# Altium schematic sheet Sheet1.SchDoc
size A3
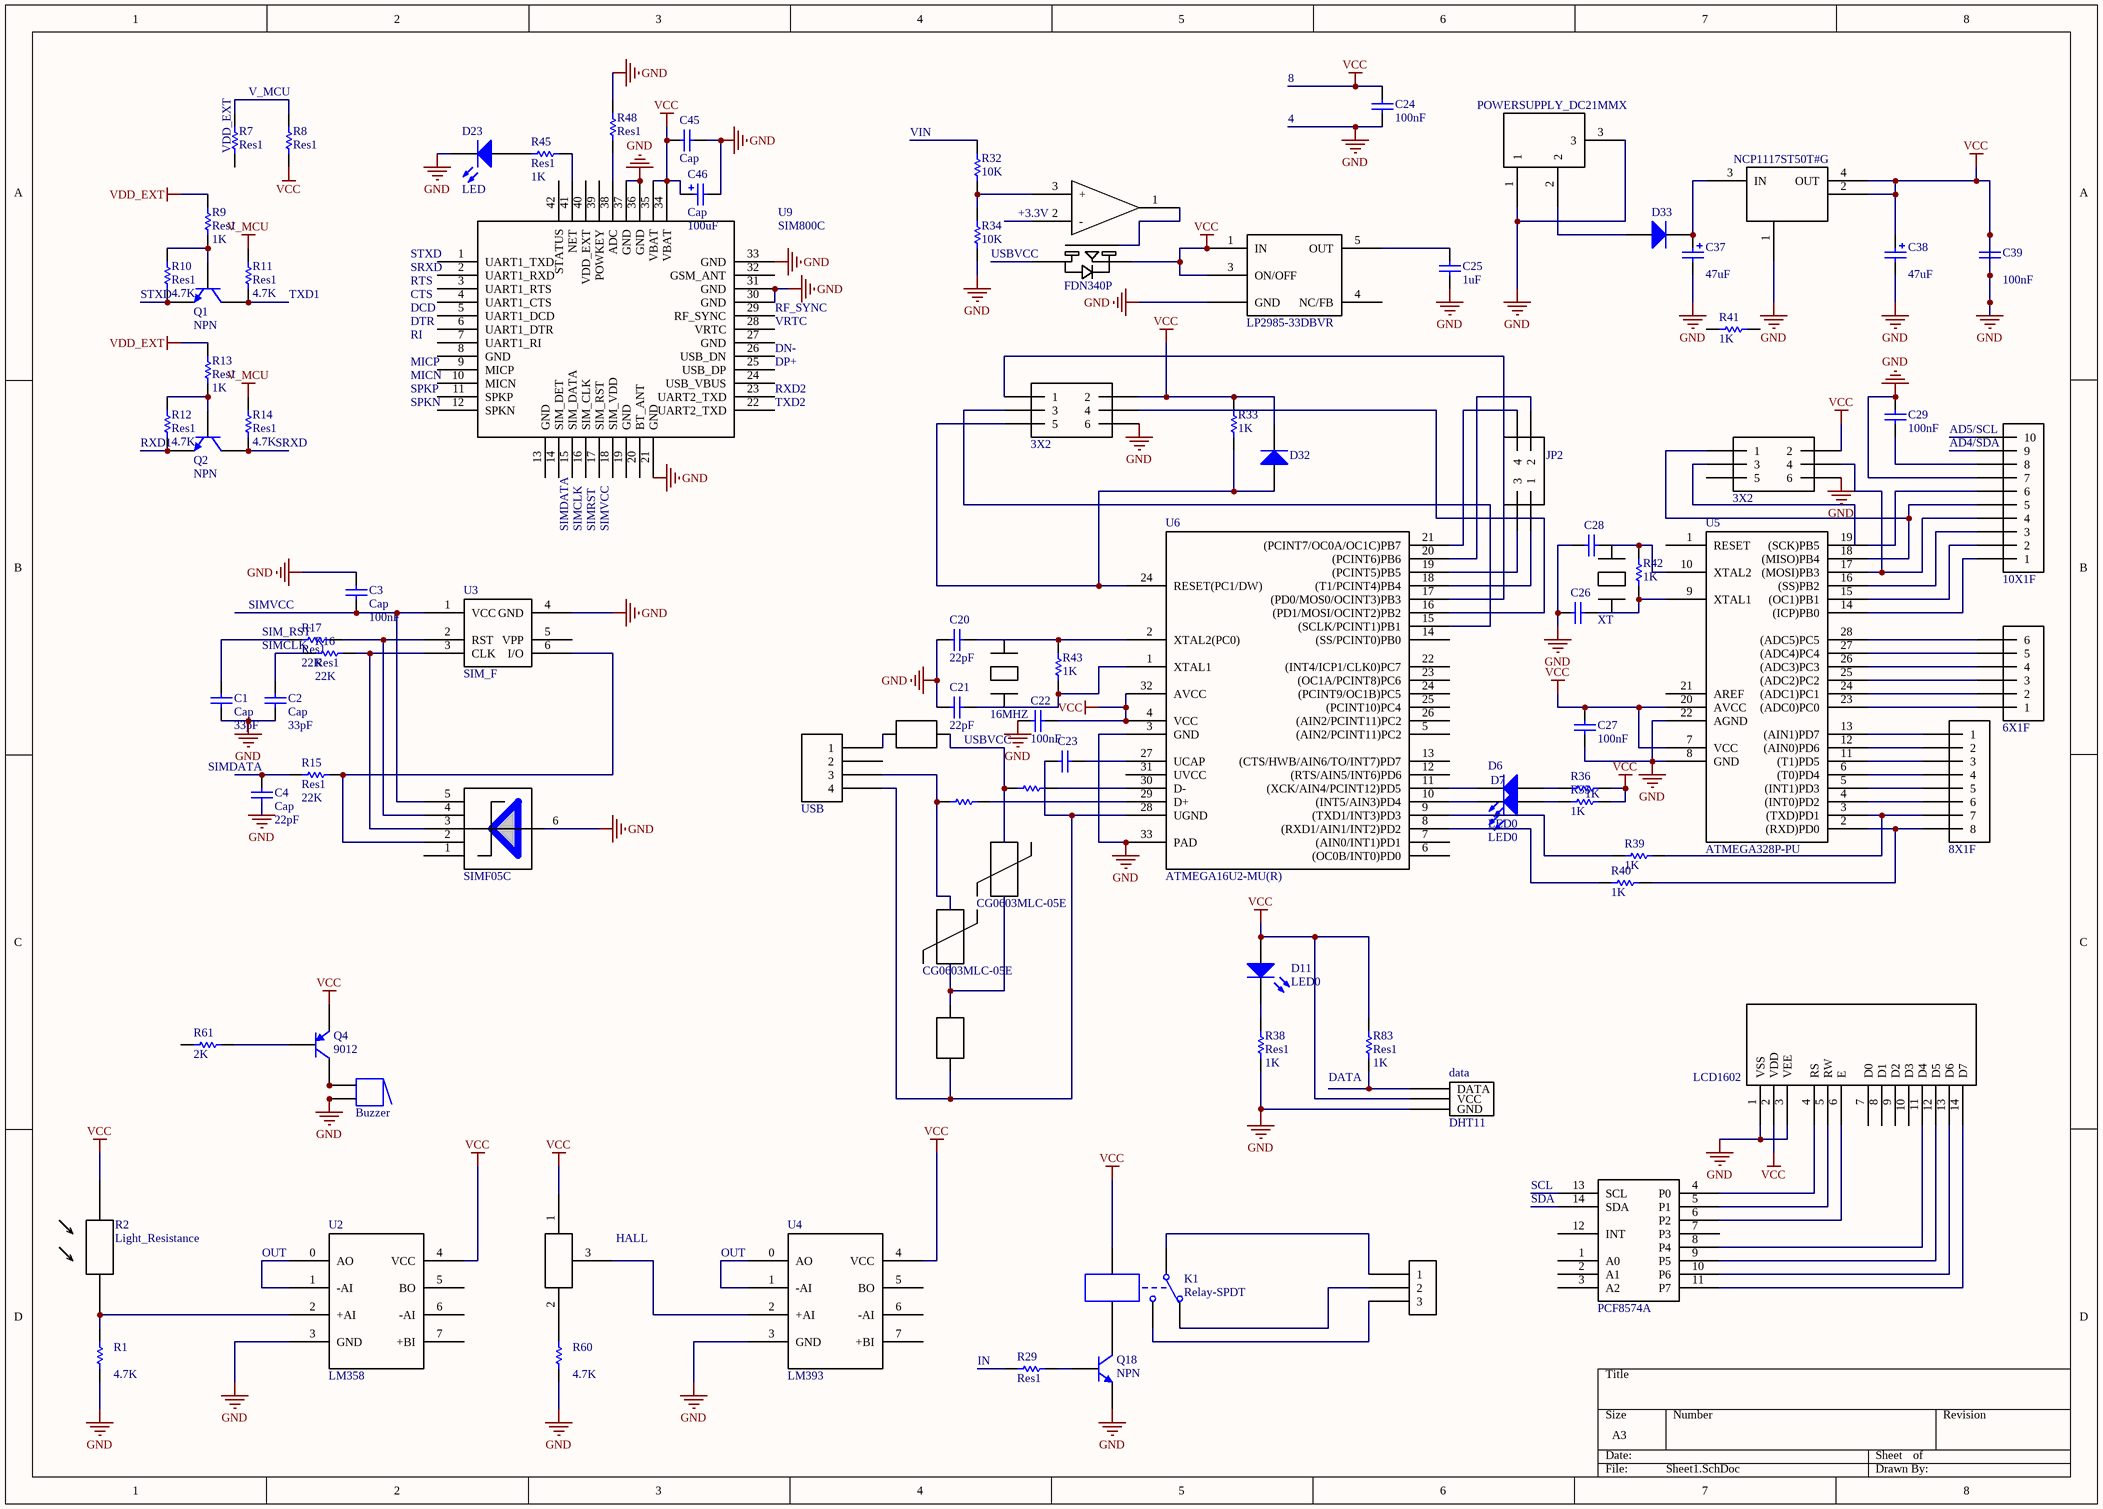
[diagram p0: Sheet1.SchDoc]

## Parts
011  LCD1602
12  JICHENG  (value not drawn)
15  XT
031  3  (value not drawn)
33  3X2
48  BLM  (value not drawn)
51  FDN340P
65  16MHZ
71  6X1F
77  USB
81  NCP1117ST50T#G
87  BLM  (value not drawn)
92  10X1F
95  CG0603MLC-05E
0122  PCF8574A
166  POWERSUPPLY_DC21MMX
231  LP2985-33DBVR
626  JP2
912  8X1F
2662  3X2
*  HALL
*?  CG0603MLC-05E
?  Buzzer  [ABSM-1574]
C1  Cap  value 33pF  [RAD-0.3]
C2  Cap  [RAD-0.3]
C3  Cap  value 100nF  [RAD-0.3]
C4  Cap  value 22pF  [RAD-0.3]
C20  value 22pF  [RAD-0.3]  (hidden comment: Cap)
C21  value 22pF  [RAD-0.3]  (hidden comment: Cap)
C22  value 100nF  [RAD-0.3]  (hidden comment: Cap)
C23  Cap  [RAD-0.3]  (value not drawn)
C24  value 100nF  [RAD-0.3]  (hidden comment: Cap)
C25  value 1uF  [RAD-0.3]  (hidden comment: Cap)
C26  Cap  [RAD-0.3]  (value not drawn)
C27  value 100nF  [RAD-0.3]  (hidden comment: Cap)
C28  Cap  [RAD-0.3]  (value not drawn)
C29  value 100nF  [RAD-0.3]  (hidden comment: Cap)
C37  value 47uF  [POLAR0.8]  (hidden comment: Cap Pol2)
C38  value 47uF  [POLAR0.8]  (hidden comment: Cap Pol2)
C39  value 100nF  [C1206]  (hidden comment: Cap Semi)
C45  Cap  [RAD-0.3]
C46  Cap  value 100uF  [POLAR0.8]
D6  LED0  [LED-0]
D7  LED0  [LED-0]
D11  LED0  [LED-0]
D23  LED  [LED-1]
D32  Diode  [SMC]  (value not drawn)
D33  Diode  [SMC]  (value not drawn)
data  DHT11
K1  Relay-SPDT  [MODULE5B]
Q1  NPN  [TO-226-AA]
Q2  NPN  [TO-226-AA]
Q4  9012  [SOT-23B_N]
Q18  NPN  [TO-92A]
R1  value 4.7K  [AXIAL-0.3]  (hidden comment: Res1)
R2  Light_Resistance
R7  Res1  [AXIAL-0.3]
R8  Res1  [AXIAL-0.3]
R9  Res1  value 1K  [AXIAL-0.3]
R10  Res1  value 4.7K  [AXIAL-0.3]
R11  Res1  value 4.7K  [AXIAL-0.3]
R12  Res1  value 4.7K  [AXIAL-0.3]
R13  Res1  value 1K  [AXIAL-0.3]
R14  Res1  value 4.7K  [AXIAL-0.3]
R15  Res1  [AXIAL-0.3]
R16  Res1  value 22K  [AXIAL-0.3]
R17  Res1  value 22K  [AXIAL-0.3]
R29  Res1  [AXIAL-0.3]
R32  value 10K  [AXIAL-0.3]  (hidden comment: Res1)
R33  value 1K  [AXIAL-0.3]  (hidden comment: Res1)
R34  value 10K  [AXIAL-0.3]  (hidden comment: Res1)
R35  value 1K  [AXIAL-0.3]  (hidden comment: Res1)
R36  value 1K  [AXIAL-0.3]  (hidden comment: Res1)
R38  Res1  value 1K  [AXIAL-0.3]
R39  value 1K  [AXIAL-0.3]  (hidden comment: Res1)
R40  value 1K  [AXIAL-0.3]  (hidden comment: Res1)
R41  value 1K  [AXIAL-0.3]  (hidden comment: Res1)
R42  value 1K  [AXIAL-0.3]  (hidden comment: Res1)
R43  value 1K  [AXIAL-0.3]  (hidden comment: Res1)
R45  Res1  value 1K  [AXIAL-0.3]
R48  Res1  [AXIAL-0.3]
R60  value 4.7K  [AXIAL-0.3]  (hidden comment: Res1)
R61  value 2K  [AXIAL-0.3]  (hidden comment: Res1)
R83  Res1  value 1K  [AXIAL-0.3]
R88  Res1  [AXIAL-0.3]  (value not drawn)
R?  Res1  [AXIAL-0.3]  (value not drawn)
sd  SIMF05C
U2  LM358
U3  SIM_F
U4  LM393
U5  ATMEGA328P-PU
U6  ATMEGA16U2-MU(R)
U9  SIM800C

## Nets
GND: 011.1(VSS) 011.2(VDD) 011.3(VEE) 33.3(2) 33.7(6) 51.15 81.1 81.2 81.4(OUT) 92.7 166.1 166.3 231.1(IN) 231.2(GND) 231.3(ON/OFF) 2662.3(2) 2662.7(6) *.1 ?.2 ?.2A C1.1 C2.1 C3.2 C4.1 C20.1 C21.1 C22.1 C22.2 C24.1 C24.2 C25.1 C26.1 C27.1 C27.2 C28.1 C29.2 C37.2 C38.1 C38.2 C39.1 C39.2 C45.1 C45.2 C46.1 C46.2 D11.1(A) D23.2(K) D32.2(K) data.18(VCC) data.19(GND) K1.4 Q4.3(E) Q18.1(E) R1.1 R2.9 R8.1 R33.2 R34.1 R35.2 R36.2 R38.1 R48.2 R60.1 R83.2 U2.3(GND) U2.4(VCC) U3.4(GND) U4.3(GND) U4.4(VCC) U5.7(VCC) U5.8(GND) U5.20(AVCC) U5.22(AGND) U6.3(GND) U6.4(VCC) U6.32(AVCC) U6.33(PAD) U9.21(GND) U9.30(GND) U9.31(GND) U9.33(GND) U9.34(VBAT) U9.35(VBAT) U9.36(GND) U9.37(GND)  [also labelled VCC]
V_MCU: R11.2 R14.2
VDD_EXT: R9.2 R13.2
Net011_4: 011.4(RS) 0122.4(P0)
Net011_5: 011.5(RW) 0122.5(P1)
Net011_6: 011.6(E) 0122.6(P2)
Net011_11: 011.11(D4) 0122.8(P4)
Net011_12: 011.12(D5) 0122.9(P5)
Net011_13: 011.13(D6) 0122.10(P6)
Net011_14: 011.14(D7) 0122.11(P7)
Net12_1: 12.1 51.14
Net12_3: 12.3(+) R32.1 R34.2
Net031_1: 031.1 K1.1
Net031_2: 031.2 K1.2
Net031_3: 031.3 K1.3
Net33_2: 33.2(1) U6.17((PD0/MOS0/OCINT3)PB3)
Net33_4: 33.4(3) U6.15((SCLK/PCINT1)PB1)
Net33_5: 33.5(4) U6.16((PD1/MOSI/OCINT2)PB2)
Net33_6: 33.6(5) D32.1(A) R33.1 U6.24((PCINT9/OC1B)PC5)
Net71_1: 71.1 U5.23((ADC0)PC0)
Net71_2: 71.2 U5.24((ADC1)PC1)
Net71_3: 71.3 U5.25((ADC2)PC2)
Net71_4: 71.4 U5.26((ADC3)PC3)
Net71_5: 71.5 U5.27((ADC4)PC4)
Net71_6: 71.6 U5.28((ADC5)PC5)
Net77_10: 77.10(3) R88.1
Net77_11: 77.11(4) C23.1 U6.28(UGND)
Net81_3: 81.3(IN) C37.1 D33.2(K)
Net92_1: 92.1 U5.14((ICP)PB0)
Net92_2: 92.2 U5.15((OC1)PB1)
Net92_3: 92.3 U5.16((SS)PB2)
Net92_4: 92.4 2662.5(4) U5.17((MOSI)PB3)
Net92_5: 92.5 2662.2(1) U5.18((MISO)PB4)
Net92_6: 92.6 U5.19((SCK)PB5)
Net92_8: 92.8 C29.1
Net166_2: 166.2 D33.1(A)
Net231_5: 231.5(OUT) C25.2
Net626_2: 626.2(1) U6.18((T1/PCINT4)PB4)
Net626_3: 626.3(2) U6.20((PCINT6)PB6)
Net626_4: 626.4(3) U6.19((PCINT5)PB5)
Net626_5: 626.5(4) U6.21((PCINT7/OC0A/OC1C)PB7)
Net912_5: 912.5(1) U5.13((AIN1)PD7)
Net912_6: 912.6(2) U5.12((AIN0)PD6)
Net912_7: 912.7(3) U5.11((T1)PD5)
Net912_8: 912.8(4) U5.6((T0)PD4)
Net912_9: 912.9(5) U5.5((INT1)PD3)
Net912_10: 912.10(6) U5.4((INT0)PD2)
Net912_11: 912.11(7) R39.2 U5.3((TXD)PD1)
Net912_12: 912.12(8) R40.2 U5.2((RXD)PD0)
Net*_2: *.2 R60.2
Net*_3: *.3 U4.2(+AI)
Net?_1: ?.1 ?.1A Q4.1(C)
NetC1_2: C1.2 R17.1
NetC2_2: C2.2 R16.1
NetC3_1: C3.1 sd.5 U3.1(VCC)
NetC4_2: C4.2 R15.1
NetC20_2: C20.2 R43.2 U6.2(XTAL2(PC0))
NetC21_2: C21.2 R43.1 U6.1(XTAL1)
NetC23_2: C23.2 U6.27(UCAP)
NetC26_2: C26.2 R42.1 U5.9(XTAL1)
NetC28_2: C28.2 R42.2 U5.10(XTAL2)
NetD6_1: D6.1(A) R36.1
NetD6_2: D6.2(K) U6.11((XCK/AIN4/PCINT12)PD5)
NetD7_1: D7.1(A) R35.1
NetD7_2: D7.2(K) U6.10((INT5/AIN3)PD4)
NetD11_2: D11.2(K) R38.2
NetD23_1: D23.1(A) R45.1
Netdata_17: data.17(DATA) R83.1
NetK1_5: K1.5 Q18.3(C)
NetQ1_1: Q1.1(C) R11.1
NetQ1_2: Q1.2(B) R9.1 R10.2
NetQ1_3: Q1.3(E) R10.1
NetQ2_1: Q2.1(C) R14.1
NetQ2_2: Q2.2(B) R12.2 R13.1
NetQ2_3: Q2.3(E) R12.1
NetQ4_2: Q4.2(B) R61.1
NetQ18_2: Q18.2(B) R29.2
NetR1_2: R1.2 R2.8 U2.2(+AI)
NetR7_2: R7.2 R8.2
NetR15_2: R15.2 sd.2 U3.6(I/O)
NetR16_2: R16.2 sd.3 U3.3(CLK)
NetR17_2: R17.2 sd.4 U3.2(RST)
NetR39_1: R39.1 U6.9((TXD1/INT3)PD3)
NetR40_1: R40.1 U6.8((RXD1/AIN1/INT2)PD2)
NetR45_2: R45.2 U9.41(NET)
NetR48_1: R48.1 U9.38(ADC)
NetR88_2: R88.2 U6.29(D+)
NetR?_2: R?.2 U6.30(D-)
NetU2_0: U2.0(AO) U2.1(-AI)
NetU4_0: U4.0(AO) U4.1(-AI)

Not connected (* = marked no-connect by the designer): 011 7(D0) 8(D1) 9(D2) 10(D3); 12 2(-); 51 16; 77 8(1) 9(2); 92 9 10; 0122 1(A0) 2(A1) 3(A2) 7(P3) 12(INT) 13(SCL) 14(SDA); 231 4(NC/FB); 2662 4(3) 6(5); R7 1; R29 1; R32 2; R41 1 2; R61 2; R? 1; sd 1 6; U2 5(BO) 6(-AI) 7(+BI); U3 5(VPP); U4 5(BO) 6(-AI) 7(+BI); U5 1(RESET) 21(AREF); U6 5((AIN2/PCINT11)PC2) 6((OC0B/INT0)PD0) 7((AIN0/INT1)PD1) 12((RTS/AIN5/INT6)PD6) 13((CTS/HWB/AIN6/TO/INT7)PD7) 14((SS/PCINT0)PB0) 22((INT4/ICP1/CLK0)PC7) 23((OC1A/PCINT8)PC6) 25((PCINT10)PC4) 26((AIN2/PCINT11)PC2) 31(UVCC); U9 1(UART1_TXD) 2(UART1_RXD) 3(UART1_RTS) 4(UART1_CTS) 5(UART1_DCD) 6(UART1_DTR) 7(UART1_RI) 8(GND) 9(MICP) 10(MICN) 11(SPKP) 12(SPKN) 13(GND) 14(SIM_DET) 15(SIM_DATA) 16(SIM_CLK) 17(SIM_RST) 18(SIM_VDD) 19(GND) 20(BT_ANT) 22(UART2_TXD) 23(UART2_TXD) 24(USB_VBUS) 25(USB_DP) 26(USB_DN) 27(GND) 28(VRTC) 29(RF_SYNC) 32(GSM_ANT) 39(POWKEY) 40(VDD_EXT) 42(STATUS)

## Notes on the sheet
- V_MCU
- 8
- (near R7) VDD_EXT
- (near R32) VIN
- 4
- +3.3V
- (near R10) STXD
- (near R11) TXD1
- (near U9) STXD
- (near U9) SRXD
- (near U9) RTS
- (near U9) CTS
- (near U9) DCD
- (near U9) RF_SYNC
- (near R34) USBVCC
- (near U9) DTR
- RI
- (near U9) MICP
- (near U9) MICN
- (near U9) DP+
- (near U9) DN-
- (near U9) VRTC
- (near R12) RXD1
- (near R14) SRXD
- (near U9) SPKP
- (near U9) SPKN
- (near U9) RXD2
- (near U9) TXD2
- (near 92) AD5/SCL
- (near 92) AD4/SDA
- (near U9) SIMDATA
- SIMCLK
- SIMRST
- SIMVCC
- (near R17) SIM_RST
- (near R17) SIMCLK
- (near C4) SIMDATA
- USBVCC
- (near R83) DATA
- (near 0122) SCL
- (near U2) OUT
- (near U4) OUT
- (near 0122) SDA
- (near R29) IN

## Library data of the parts
65 = XT
? = Buzzer: Magnetic Transducer Buzzer; Published: 24-Mar-1999; LatestRevisionDate: 17-Dec-2003; LatestRevisionNote: Schematic revised, PCB Footprint replaced.; DatasheetVersion: 17-Dec-2003; PackageReference: ABSM-1574; Publisher: Altium Limited; PackageDescription: Magnetic Transducer Buzzer; ComponentLink1Description: Manufacturer Link; ComponentLink1URL: http://www.megastar.com/linecard/buzzmode/index.php
C1-C4 C20-C22 C24 C25 C27 C29 = Cap: Capacitor; Published: 8-Jun-2000; LatestRevisionDate: 17-Jul-2002; LatestRevisionNote: Re-released for DXP Platform.; PackageReference: RAD-0.3; Publisher: Altium Limited; PackageDescription: Radial Cap, Thru-Hole; 2 Leads; 0.3 in Pin Spacing
  C2: 33pF: 33pF
C23 = Cap: Capacitor; Value: 100nF; Published: 8-Jun-2000; LatestRevisionDate: 17-Jul-2002; LatestRevisionNote: Re-released for DXP Platform.; PackageReference: RAD-0.3; Publisher: Altium Limited; PackageDescription: Radial Cap, Thru-Hole; 2 Leads; 0.3 in Pin Spacing
C26 C28 C45 = Cap: Capacitor; Value: 100pF; Published: 8-Jun-2000; LatestRevisionDate: 17-Jul-2002; LatestRevisionNote: Re-released for DXP Platform.; PackageReference: RAD-0.3; Publisher: Altium Limited; PackageDescription: Radial Cap, Thru-Hole; 2 Leads; 0.3 in Pin Spacing
C37 C38 C46 = Cap Pol2: Polarized Capacitor (Axial); Published: 8-Jun-2000; LatestRevisionDate: 17-Jul-2002; LatestRevisionNote: Re-released for DXP Platform.; PackageReference: POLAR0.8; Publisher: Altium Limited; PackageDescription: Polarized Capacitor; 2 Leads
C39 = Cap Semi: Capacitor (Semiconductor SIM Model); Published: 8-Jun-2000; LatestRevisionDate: 29-May-2009; LatestRevisionNote: IPC-7351 Footprint Added.; PackageReference: C1206; Publisher: Altium Limited; PackageDescription: Chip Capacitor
D6 D7 D11 = LED0: Typical INFRARED GaAs LED; Published: 8-Jun-2000; LatestRevisionDate: 08-Jul-2005; LatestRevisionNote: Mech Layer 1 removed.; PackageReference: LED-0; Publisher: Altium Limited; PackageDescription: LED; 2 Leads
D23 = LED1: Typical RED GaAs LED; Published: 8-Jun-2000; LatestRevisionDate: 08-Jul-2005; LatestRevisionNote: Mech Layer 1 removed.; PackageReference: LED-1; Publisher: Altium Limited; PackageDescription: LED; 2 Leads
D32 D33 = Diode: Default Diode; Published: 8-Jun-2000; LatestRevisionDate: 17-Jul-2002; LatestRevisionNote: Re-released for DXP Platform.; PackageVersion: Sep-1996; PackageReference: SMC; Publisher: Altium Limited; PackageDescription: DO-214-AB/SMC; 2 C-Bend Leads; Body 7.9 x 5.9 mm, inc. leads (LxW); Code_JEDEC: DO-214-AB
K1 = Relay-SPDT: Single-Pole Dual-Throw Relay; Published: 24-Mar-1999; LatestRevisionDate: 17-Jul-2002; LatestRevisionNote: Re-released for DXP Platform.; PackageReference: MODULE5B; Publisher: Altium Limited
Q1 Q2 = NPN: NPN Bipolar Transistor; Published: 8-Jun-2000; LatestRevisionDate: 17-Jul-2002; LatestRevisionNote: Re-released for DXP Platform.; PackageReference: TO-226-AA; Publisher: Altium Limited; PackageDescription: TO, Flat Index; 3 In-Line, Axial Leads; Body Dia. 4.8mm; Leads 0.55 x 0.51 mm (max); Code_JEDEC: TO-226-AA
Q4 = PNP: PNP Bipolar Transistor; Published: 8-Jun-2000; LatestRevisionDate: 29-May-2009; LatestRevisionNote: IPC-7351 Footprint Added.; PackageVersion: Aug-1999; PackageReference: SOT-23B; Publisher: Altium Limited; PackageDescription: 3-Pin SOT-23 Package 0.95 mm Pitch, 2.4 mm Lead Span
Q18 = 2N3904: NPN General Purpose Amplifier; Published: 8-Jun-2000; LatestRevisionDate: 15-Jan-2003; LatestRevisionNote: PCB Footprint 'BCY-W3/D4.7' replaced; DatasheetVersion: 1997; PackageVersion: Sep-1998; PackageReference: TO-92A; Publisher: Altium Limited; PackageDescription: TO, Flat Index; 3 In-Line, Axial Leads; Body Dia. 4.5mm; Leads 0.51 x 0.48 mm (max); ComponentLink1Description: Manufacturer Link; ComponentLink1URL: http://www.fairchildsemi.com/; ComponentLink2Description: Datasheet; ComponentLink2URL: http://www.fairchildsemi.com/ds/2N%2F2N3904.pdf
R1 R9-R17 R32-R36 R38-R43 R45 R60 R61 R83 = Res1: Resistor; Published: 8-Jun-2000; LatestRevisionDate: 17-Jul-2002; LatestRevisionNote: Re-released for DXP Platform.; PackageReference: AXIAL-0.3; Publisher: Altium Limited; PackageDescription: Axial Device, Thru-Hole; 2 Leads; 0.3 in Pin Spacing
  R15: 22K: 22K
R7 R8 R29 R48 R88 R? = Res1: Resistor; Value: 1K; Published: 8-Jun-2000; LatestRevisionDate: 17-Jul-2002; LatestRevisionNote: Re-released for DXP Platform.; PackageReference: AXIAL-0.3; Publisher: Altium Limited; PackageDescription: Axial Device, Thru-Hole; 2 Leads; 0.3 in Pin Spacing
U4 = LM358